# EAGLE design blink1mk3-prog-jig1 (EAGLE 9.2.2)
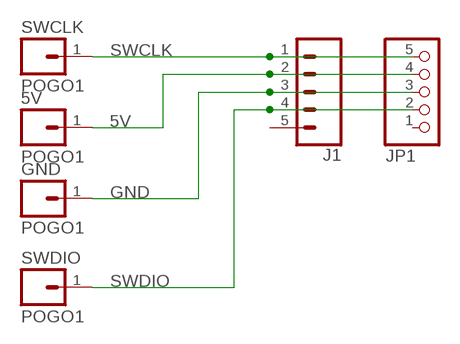
[diagram p0: schematic, sheet 1]

## Parts
5V  POGO1  [MILLMAX-0928-POGO-THRU]
GND  POGO1  [MILLMAX-0928-POGO-THRU]
J1  CONN_05  [1X05]
JP1  PINHD-1X5/90  [1X05/90]
SWCLK  POGO1  [MILLMAX-0928-POGO-THRU]
SWDIO  POGO1  [MILLMAX-0928-POGO-THRU]

## Nets
5V: 5V.1 J1.2 JP1.4
GND: GND.1 J1.3 JP1.3
SWCLK: J1.1 JP1.5 SWCLK.1
SWDIO: J1.4 JP1.2 SWDIO.1
Unconnected: J1.5 JP1.1

## Library data of the parts
5V GND SWCLK SWDIO = todstuff:POGO1
J1 = SparkFun-Connectors:CONN_05: Multi connection point. Often used as Generic Header-pin footprint for 0.1 inch spaced/style header connections On any of the 0.1 inch spaced packages, you can populate with these: Break Away Headers - Straight <https://www.sparkfun.com/products/116> (PRT-00116) Break Away Male Headers - Right Angle <https://www.sparkfun.com/products/553> (PRT-00553) Female Headers <https://www.sparkfun.com/products/115> (PRT-00115) Break Away Headers - Machine Pin <https://www.sparkfun.com/products/117> (PRT-00117) Break Away Female Headers - Swiss Machine Pin <https://www.sparkfun.com/products/743> (PRT-00743) For SCREWTERMINALS and SPRING TERMINALS visit here: Screw Terimnals on SparkFun.com <https://www.sparkfun.com/search/results?term=Screw+Terminals> (5mm/3.5mm/2.54mm spacing) This device is also useful as a general connection point to wire up your design to another part of your project. Our various solder wires solder well into these plated through hole pads. Hook-Up Wire - Assortment (Stranded, 22 AWG) <https://www.sparkfun.com/products/11375> (PRT-11375) Hook-Up Wire - Assortment (Solid Core, 22 AWG) <https://www.sparkfun.com/products/11367> (PRT-11367) View the entire wire category on our website here <https://www.sparkfun.com/categories/141> Special notes: Molex polarized connector foot print use with SKU : PRT-08231 with associated crimp pins and housings. 1MM SMD Version SKU: PRT-10208
JP1 = pinhead:PINHD-1X5: PIN HEADER

## Board
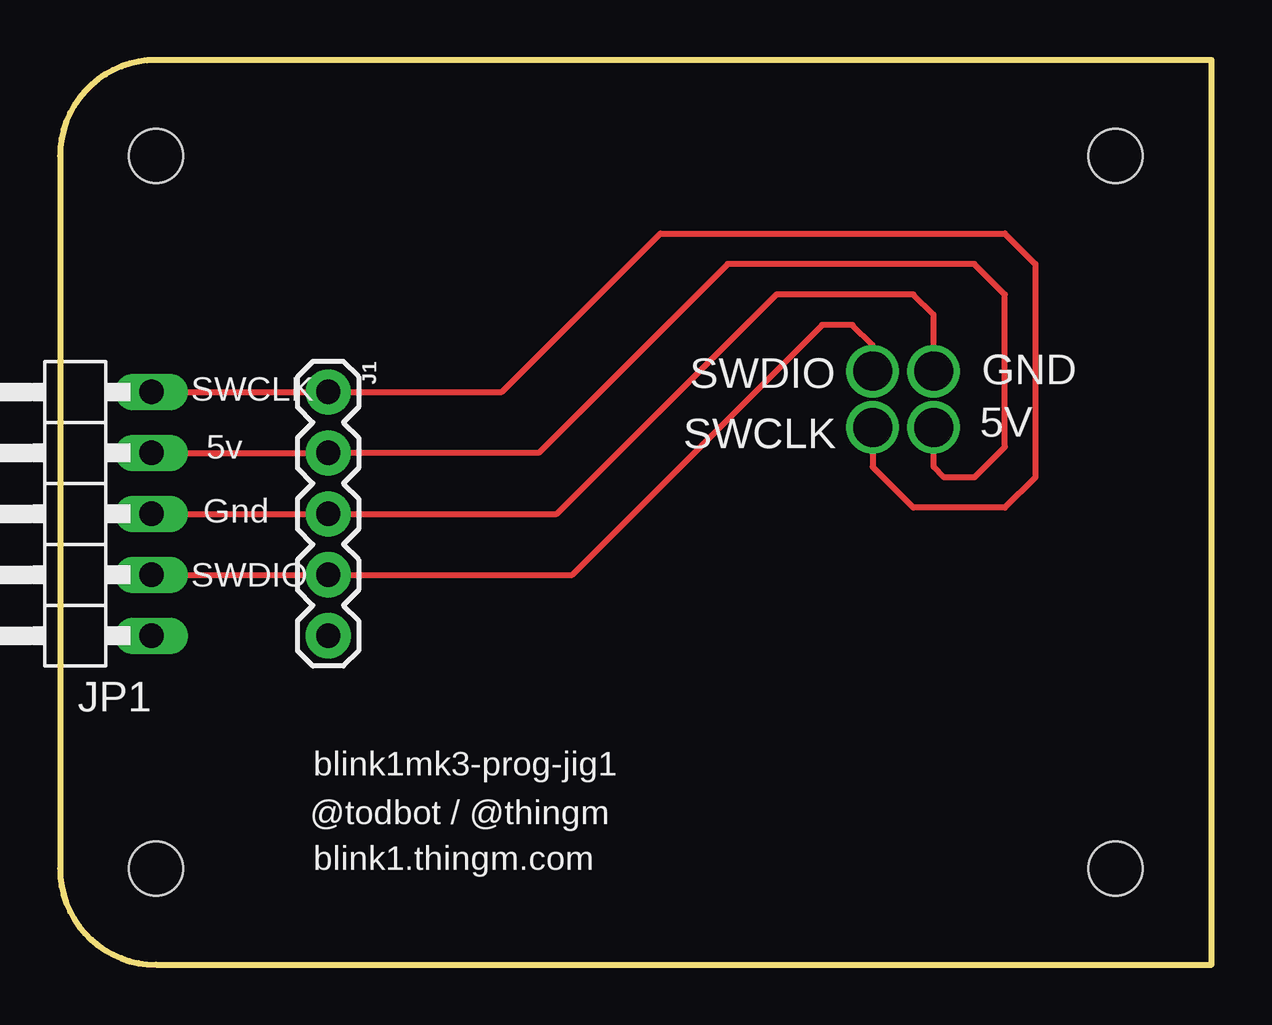
[diagram p1: board, top side]
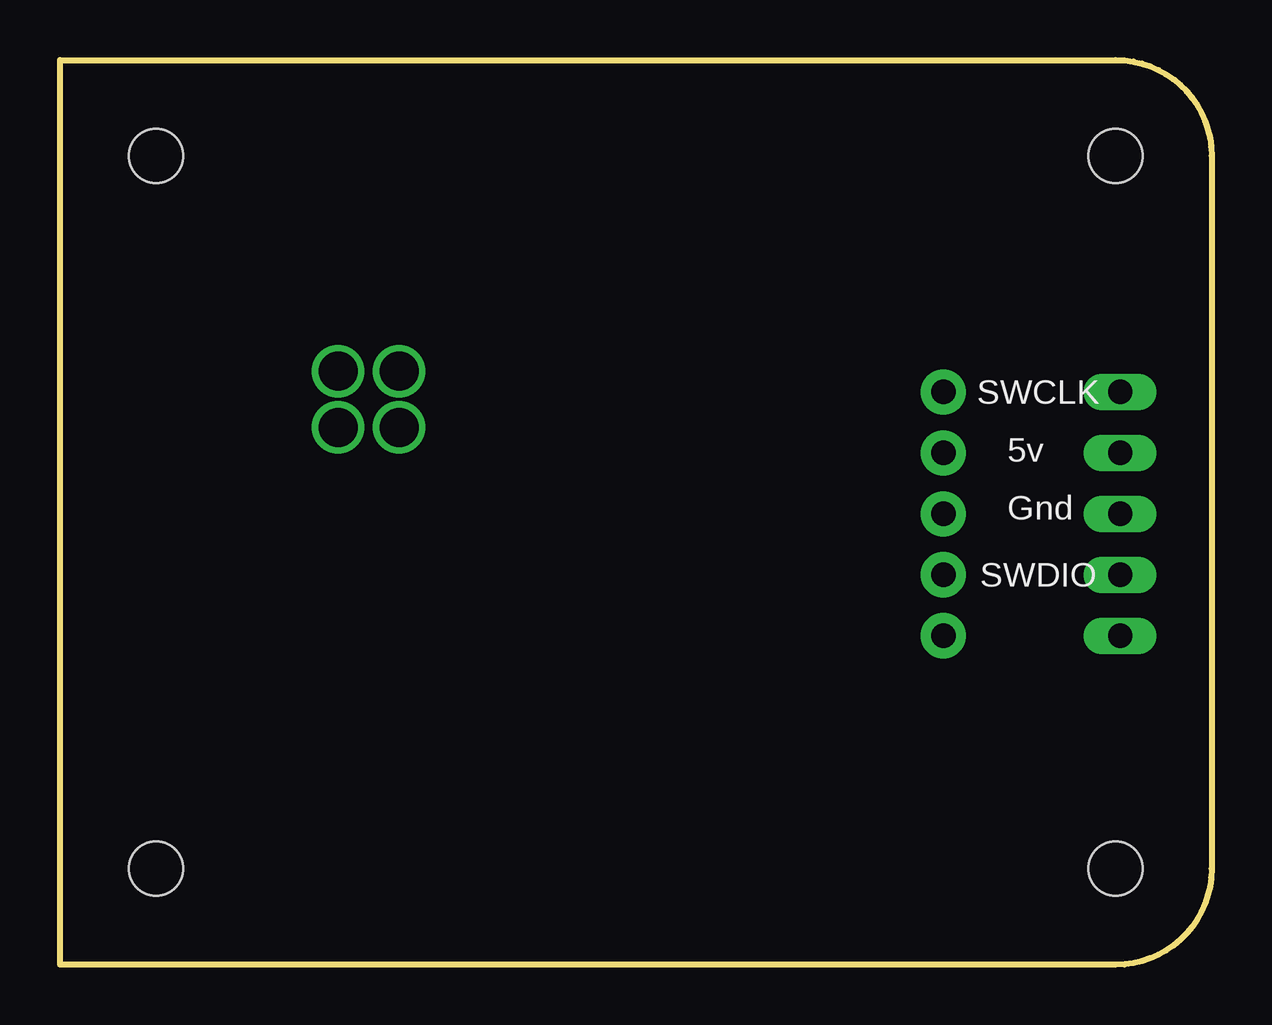
[diagram p2: board, bottom side, seen from below]

Size 47.99 x 37.72 mm. Coordinates in mm from the lower left corner, seen from the top.
Outline: 4,0 47.98,0 47.98,37.72 4,37.72 arc90 0,33.72 0,4 arc90 4,0
Copper layers (1*16): Top 0.035mm / dielectric 1.5mm / Bottom 0.035mm
Design rules "default *": minimum track width 6mil, minimum drill 0.35mm, track to track 6mil, track to pad 6mil, pad to pad 6mil, via to via 6mil, smd to smd 6mil, copper to edge 40mil, drill to drill 6mil, minimum pad ring 8mil, minimum via ring 8mil, stop-mask expansion 4mil, vias tented up to drill 0mil, thermal gap 10mil
Holes 2.25 mm at 4,4 43.99,33.72 4,33.72 43.99,4

### Footprints (pad centres in the part's own frame; a part is rotated, then mirrored left to right if it is on the bottom)
MILLMAX-0928-POGO-THRU = drill 1.626 pad 2.184: 1 0,0
1X05 = drill 1.016 pad 1.88: 1 0,0; 2 2.54,0; 3 5.08,0; 4 7.62,0; 5 10.16,0
1X05/90 = drill 1.016 long: 1 -5.08,-3.81; 2 -2.54,-3.81; 3 0,-3.81; 4 2.54,-3.81; 5 5.08,-3.81

### Placement (x,y rotation side)
5V  36.4,22.4 180 top
GND  36.4,24.74 180 top
J1  11.18,23.88 270 top
JP1  0,18.8 90 top
SWCLK  33.86,22.4 180 top
SWDIO  33.86,24.74 180 top

### Tracks (layer width: path | path; a pad name or v marks a point on that pad's centre or on a via)
5V
  Top 0.254: 5V.1 36.4,20.75 36.83,20.32 38.1,20.32 39.37,21.59 39.37,27.94 38.1,29.21 27.81,29.21 19.94,21.34 J1.2 JP1.4
GND
  Top 0.203: J1.3 11.43,18.8 | 36.4,25.83 GND.1
  Top 0.254: 11.43,18.8 20.7,18.8 29.84,27.94 35.56,27.94 36.4,27.1 GND.1 | JP1.3 J1.3
SWCLK
  Top 0.203: J1.1 11.43,23.88
  Top 0.254: 11.43,23.88 18.41,23.88 25.02,30.48 39.37,30.48 40.64,29.21 40.64,20.32 39.37,19.05 35.56,19.05 33.86,20.75 SWCLK.1 | JP1.5 J1.1
SWDIO
  Top 0.203: J1.4 11.43,16.26
  Top 0.254: 11.43,16.26 21.34,16.26 31.75,26.67 33.02,26.67 33.86,25.83 SWDIO.1 | JP1.2 J1.4

### Text on the board
tPlace: SWCLK | 5v | Gnd | SWDIO | blink1mk3-prog-jig1 | @todbot / @thingm | blink1.thingm.com
bPlace: SWCLK | 5v | Gnd | SWDIO